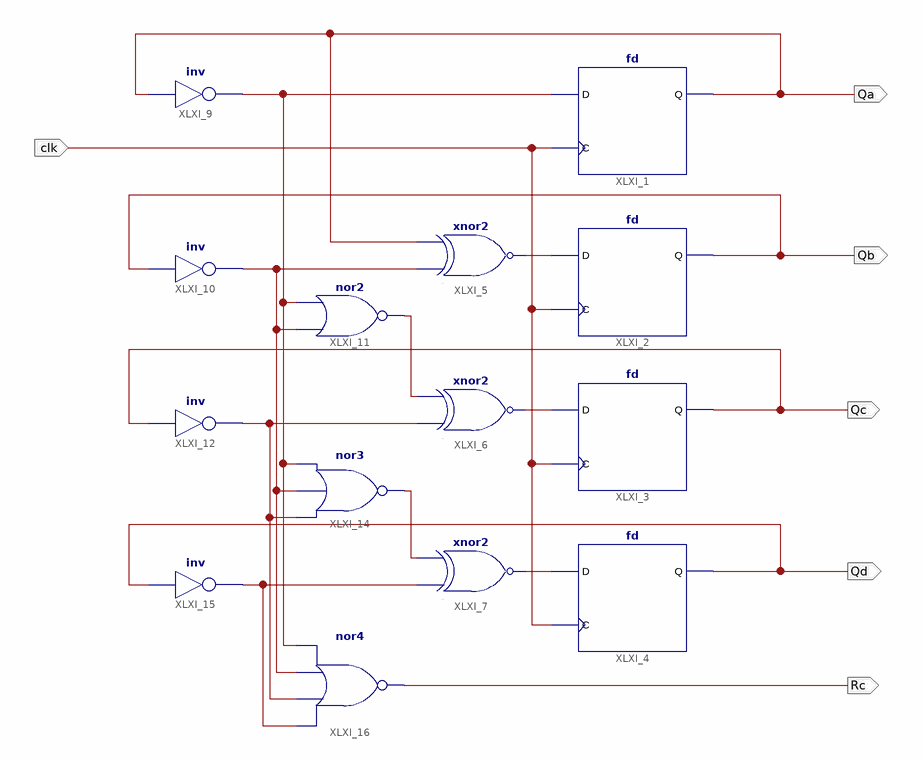
[diagram p0: schematic sheet 1]
// Xilinx ISE schematic Counter4b.sch (kintex7) as structural Verilog: 14 symbols, 6 ports
module Counter4b (
  input  clk,
  output Qb,
  output Qc,
  output Qd,
  output Qa,
  output Rc
);

  wire XLXN_10, XLXN_11, XLXN_12, XLXN_15, XLXN_18, XLXN_24, XLXN_25, XLXN_26, XLXN_27;

  fd XLXI_1 (.C(clk), .D(XLXN_18), .Q(Qa));
  fd XLXI_2 (.C(clk), .D(XLXN_10), .Q(Qb));
  fd XLXI_3 (.C(clk), .D(XLXN_11), .Q(Qc));
  fd XLXI_4 (.C(clk), .D(XLXN_12), .Q(Qd));
  xnor XLXI_5 (XLXN_10, XLXN_15, Qa);
  xnor XLXI_6 (XLXN_11, XLXN_25, XLXN_24);
  xnor XLXI_7 (XLXN_12, XLXN_27, XLXN_26);
  not XLXI_9 (XLXN_18, Qa);
  not XLXI_10 (XLXN_15, Qb);
  nor XLXI_11 (XLXN_24, XLXN_15, XLXN_18);
  not XLXI_12 (XLXN_25, Qc);
  nor XLXI_14 (XLXN_26, XLXN_25, XLXN_15, XLXN_18);
  not XLXI_15 (XLXN_27, Qd);
  nor XLXI_16 (Rc, XLXN_27, XLXN_25, XLXN_15, XLXN_18);
endmodule
